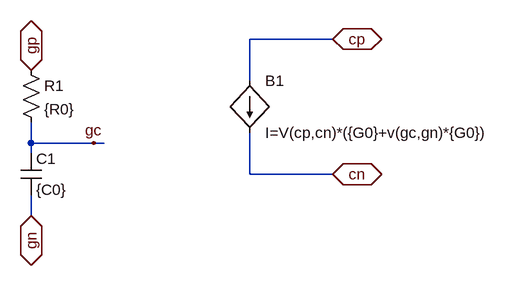
[diagram p0: schematic capteur.asc]
capteur.asc, the LTspice schematic file:
Version 4
SHEET 1 900 680
WIRE 592 32 464 32
WIRE 464 96 464 32
WIRE 128 192 128 160
WIRE 224 192 128 192
WIRE 240 192 224 192
WIRE 128 208 128 192
WIRE 464 240 464 176
WIRE 592 240 464 240
WIRE 128 304 128 272
FLAG 128 80 gp
IOPIN 128 80 BiDir
FLAG 128 304 gn
IOPIN 128 304 BiDir
FLAG 224 192 gc
FLAG 592 240 cn
IOPIN 592 240 BiDir
FLAG 592 32 cp
IOPIN 592 32 BiDir
SYMBOL res 112 64 R0
SYMATTR InstName R1
SYMATTR Value {R0}
SYMBOL cap 112 208 R0
SYMATTR InstName C1
SYMATTR Value {C0}
SYMBOL bi 464 96 R0
SYMATTR InstName B1
SYMATTR Value I=V(cp,cn)*({G0}+v(gc,gn)*{G0})

The netlist it stands for:
* capteur.asc
R1 gp gc {R0}
C1 gc gn {C0}
B1 cp cn I=V(cp,cn)*({G0}+v(gc,gn)*{G0})
.backanno
.end